# EAGLE design Controller + Power (Sliced) (EAGLE 9.6.2)
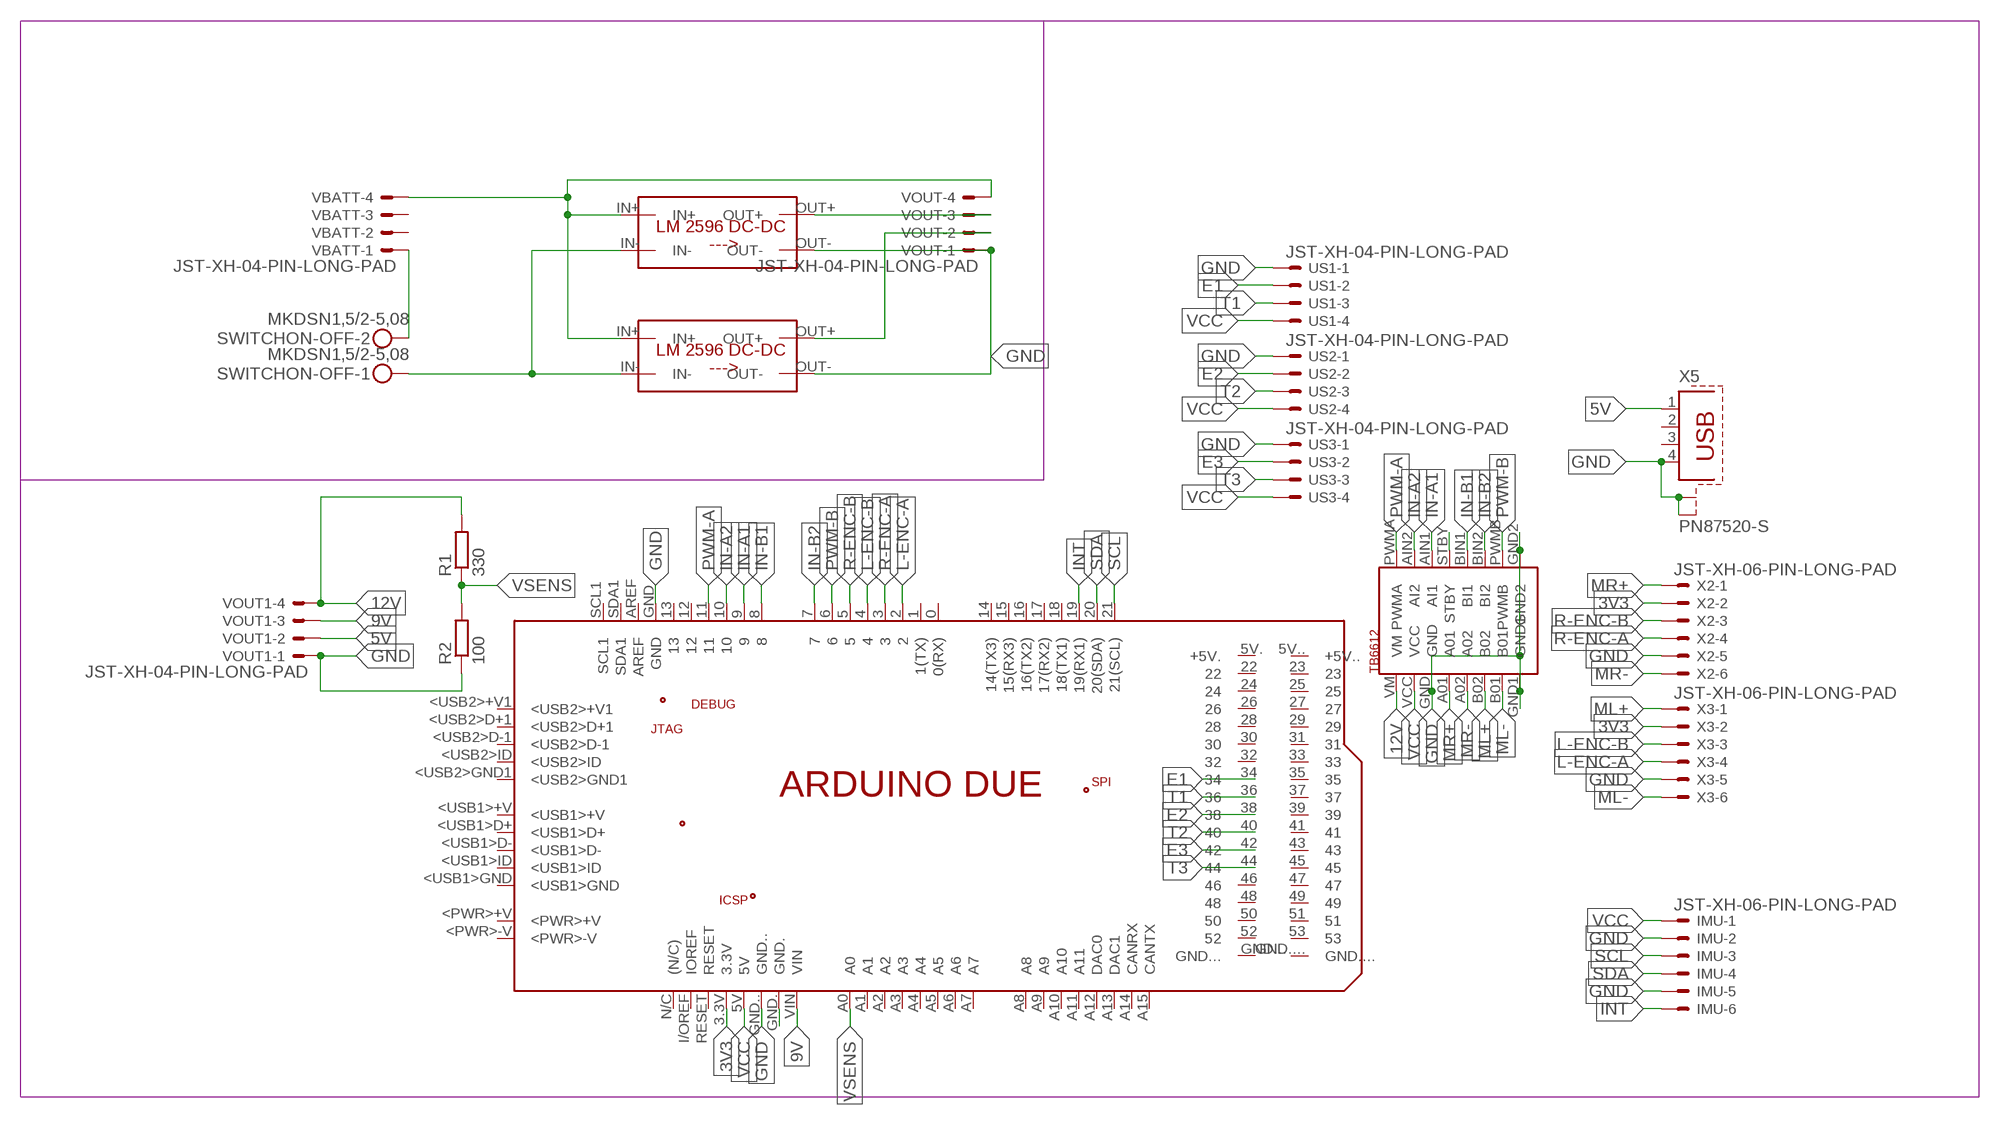
[diagram p0: schematic, sheet 1]

## Parts
IMU  JST-XH-06-PIN-LONG-PAD  [JST-XH-06-PACKAGE-LONG-PAD]
PCB1  ARDUINO_DUE  [ARDUINO_DUE]
R1  330  R-EU_R1206  [R1206]
R2  100  R-EU_R1206  [R1206]
SWITCHON-OFF  MKDSN1,5/2-5,08  [MKDSN1,5/2-5,08]
U$1  LM2596_MODBUCK  [LM2596_MOD]
U$2  LM2596_MODBUCK  [LM2596_MOD]
U$3  TB6612  [TB6612]
US1  JST-XH-04-PIN-LONG-PAD  [JST-XH-04-PACKAGE-LONG-PAD]
US2  JST-XH-04-PIN-LONG-PAD  [JST-XH-04-PACKAGE-LONG-PAD]
US3  JST-XH-04-PIN-LONG-PAD  [JST-XH-04-PACKAGE-LONG-PAD]
VBATT  JST-XH-04-PIN-LONG-PAD  [JST-XH-04-PACKAGE-LONG-PAD]
VOUT  JST-XH-04-PIN-LONG-PAD  [JST-XH-04-PACKAGE-LONG-PAD]
VOUT1  JST-XH-04-PIN-LONG-PAD  [JST-XH-04-PACKAGE-LONG-PAD]
X2  JST-XH-06-PIN-LONG-PAD  [JST-XH-06-PACKAGE-LONG-PAD]
X3  JST-XH-06-PIN-LONG-PAD  [JST-XH-06-PACKAGE-LONG-PAD]
X5  PN87520-S  [PN87520-S]

## Nets
3V3: PCB1.3.3V X2.2 X3.2
5V: VOUT1.2 X5.1
9V: PCB1.VIN VOUT1.3
12V: R1.2 U$3.VM VOUT1.4
E1: PCB1.34 US1.2
E2: PCB1.38 US2.2
E3: PCB1.42 US3.2
GND: IMU.2 IMU.5 PCB1.GND PCB1.GND.. R2.1 U$1.OUT- U$2.OUT- U$3.GND U$3.GND1 U$3.GND2 US1.1 US2.1 US3.1 VOUT1.1 VOUT.1 X2.5 X3.5 X5.4 X5.S1 X5.S2
IN-A1: PCB1.9 U$3.AIN1(AI1)
IN-A2: PCB1.10 U$3.AIN2(AI2)
IN-B1: PCB1.8 U$3.BIN1(BI1)
IN-B2: PCB1.7 U$3.BIN2(BI2)
INT: IMU.6 PCB1.19(19(RX1))
L-ENC-A: PCB1.2 X3.4
L-ENC-B: PCB1.4 X3.3
ML+: U$3.B02 X3.1
ML-: U$3.B01 X3.6
MR+: U$3.A01 X2.1
MR-: U$3.A02 X2.6
N$1: U$1.IN+ U$2.IN+ VBATT.4 VOUT.4
N$2: SWITCHON-OFF.2 VBATT.1
N$3: SWITCHON-OFF.1 U$1.IN- U$2.IN-
N$4: U$2.OUT+ VOUT.3
N$5: U$1.OUT+ VOUT.2
N$8: PCB1.GND.
N$12: U$3.STBY
PWM-A: PCB1.11 U$3.PWMA
PWM-B: PCB1.6 U$3.PWMB
R-ENC-A: PCB1.3 X2.4
R-ENC-B: PCB1.5 X2.3
SCL: IMU.3 PCB1.21(21(SCL))
SDA: IMU.4 PCB1.20(20(SDA))
T1: PCB1.36 US1.3
T2: PCB1.40 US2.3
T3: PCB1.44 US3.3
VCC: IMU.1 PCB1.5V U$3.VCC US1.4 US2.4 US3.4
VSENS: PCB1.A0 R1.1 R2.2
Unconnected: PCB1.0(0(RX)) PCB1.1(1(TX)) PCB1.5V.(+5V.) PCB1.5V..(+5V..) PCB1.12 PCB1.13 PCB1.14(14(TX3)) PCB1.15(15(RX3)) PCB1.16(16(TX2)) PCB1.17(17(RX2)) PCB1.18(18(TX1)) PCB1.22 PCB1.23 PCB1.24 PCB1.25 PCB1.26 PCB1.27 PCB1.28 PCB1.29 PCB1.30 PCB1.31 PCB1.32 PCB1.33 PCB1.35 PCB1.37 PCB1.39 PCB1.41 PCB1.43 PCB1.45 PCB1.46 PCB1.47 PCB1.48 PCB1.49 PCB1.50 PCB1.51 PCB1.52 PCB1.53 PCB1.+3.3V PCB1.+5V PCB1.+5V_ PCB1.<PWR>+V PCB1.<PWR>-V PCB1.<USB1>+V PCB1.<USB1>D+ PCB1.<USB1>D- PCB1.<USB1>GND PCB1.<USB1>ID PCB1.<USB2>+V1 PCB1.<USB2>D+1 PCB1.<USB2>D-1 PCB1.<USB2>GND1 PCB1.<USB2>ID PCB1.A1 PCB1.A2 PCB1.A3 PCB1.A4 PCB1.A5 PCB1.A6 PCB1.A7 PCB1.A8 PCB1.A9 PCB1.A10 PCB1.A11 PCB1.A12(DAC0) PCB1.A13(DAC1) PCB1.A14(CANRX) PCB1.A15(CANTX) PCB1.AREF PCB1.GND1 PCB1.GND1. PCB1.GND1.. PCB1.GND1... PCB1.GND... PCB1.GND.... PCB1.GND_ PCB1.GND__ PCB1.I/OREF(IOREF) PCB1.MISO PCB1.MISO2 PCB1.MOSI PCB1.MOSI2 PCB1.N/C((N/C)) PCB1.N/C. PCB1.RESET PCB1.RESET2 PCB1.RESET. PCB1.RESET.. PCB1.RESET_ PCB1.SCK PCB1.SCK2 PCB1.SCL1 PCB1.SDA1 PCB1.SWCLK PCB1.SWDIO PCB1.TCK PCB1.TDI PCB1.TDO PCB1.TMS VBATT.2 VBATT.3 X5.2 X5.3

## Library data of the parts
IMU X2 X3 = Rembrandt Electronics - JST XH Connectors v1-0:JST-XH-06-PIN: JST XH Connector 2 Pin Wire to board connector. Pitch: 2,54 mm, (0.100") Number of pins: 6 Created by Rembrandt Electronics www.rembrandtelectronics.com
PCB1 = E14_Arduino_revC:ARDUINO_DUE: Device for representing an Arduino Due board with a footprint in an EAGLE design. Created by Dave Young for Element14. More EAGLE documentation at: http://www.element14.com/community/community/knode/cadsoft_eagle
R1 R2 = rcl:R-EU_: RESISTOR, European symbol; SPICEPREFIX: R
SWITCHON-OFF = con-phoenix-508:MKDSN1,5/2-5,08: MKDSN 1,5/ 2-5,08 Printklemme Nennstrom: 13,5 A Nennspannung: 250 V Rastermaß: 5,08 mm Polzahl: 2 Anschlussart: Schraubanschluss Montage: Löten Anschlussrichtung Leiter/Platine: 0 ° Artikelnummer: 1729128 Source: http://eshop.phoenixcontact.com .. 1729128.pdf
U$1 U$2 = LM2596:LM2596_MOD
U$3 = DRIVER-MOTOR-TB6612:TB6612
US1-US3 VBATT VOUT VOUT1 = Rembrandt Electronics - JST XH Connectors v1-0:JST-XH-04-PIN: JST XH Connector 2 Pin Wire to board connector. Pitch: 2,54 mm, (0.100") Number of pins: 4 Created by Rembrandt Electronics www.rembrandtelectronics.com
X5 = con-berg:PN87520-S; OC_FARNELL: unknown; OC_NEWARK: unknown

## Board
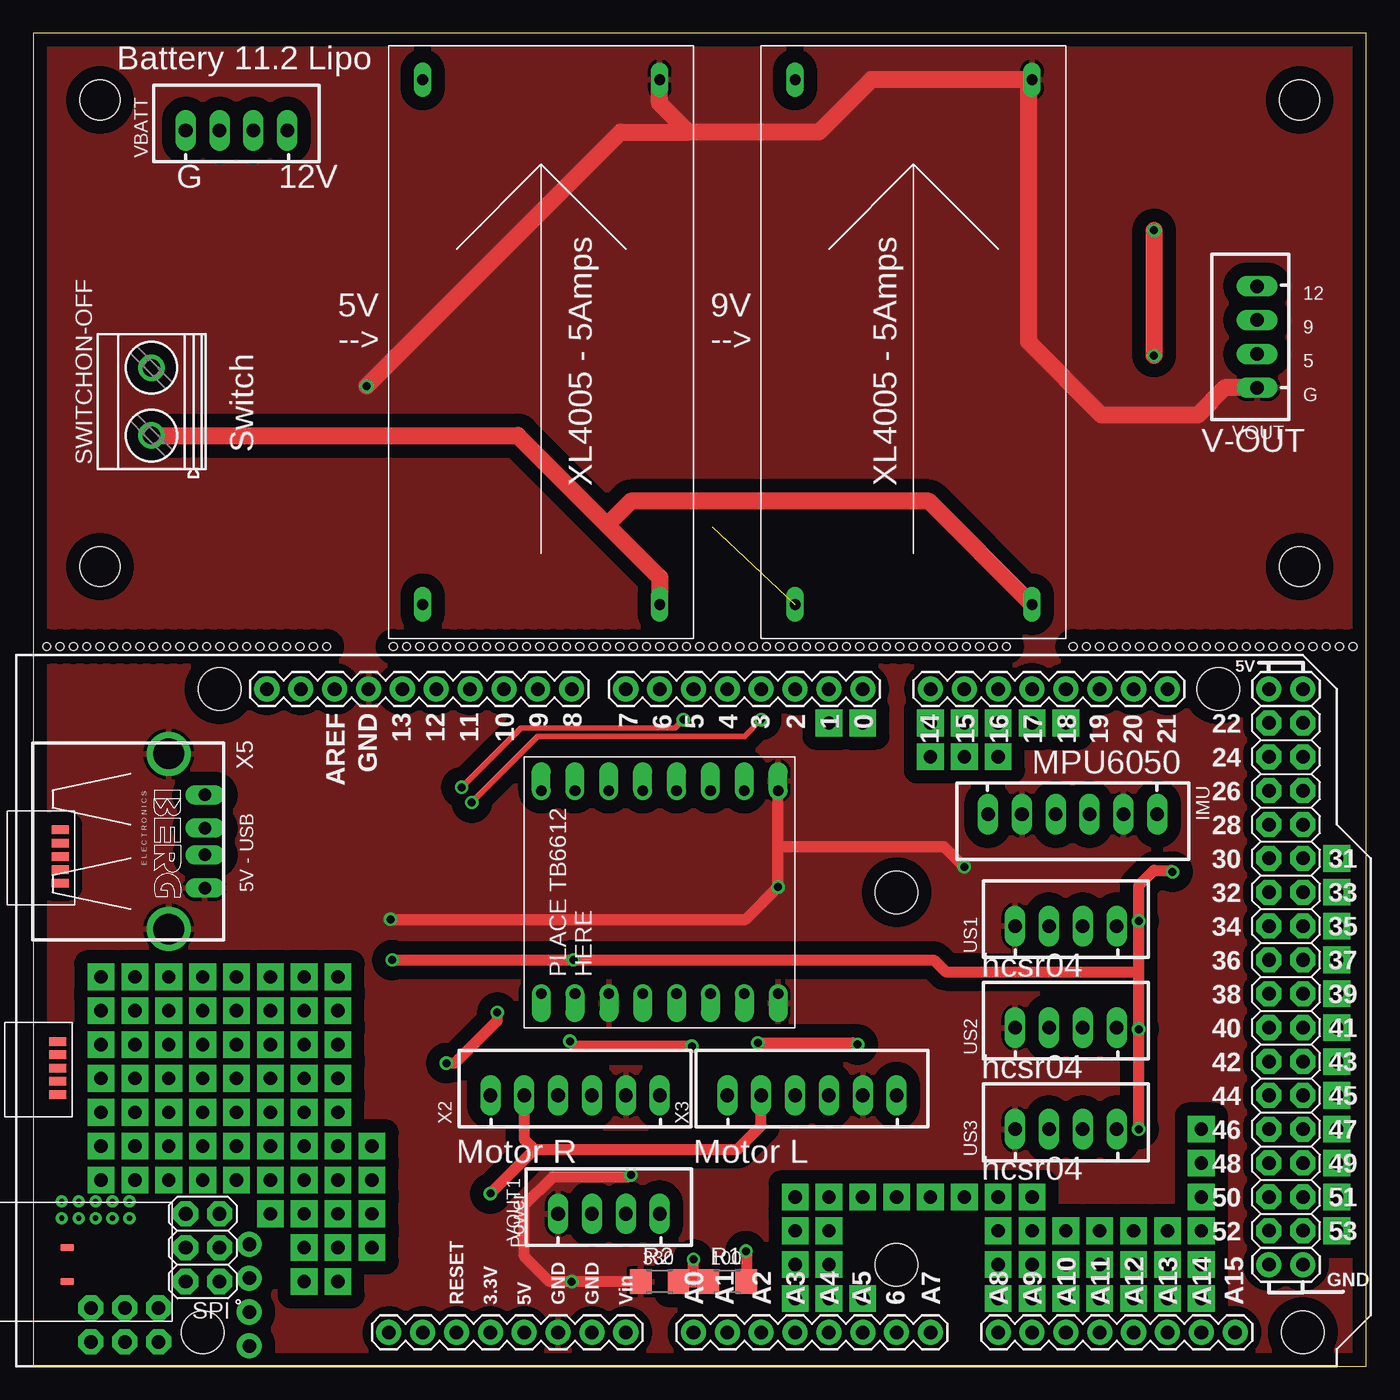
[diagram p1: board, top side]
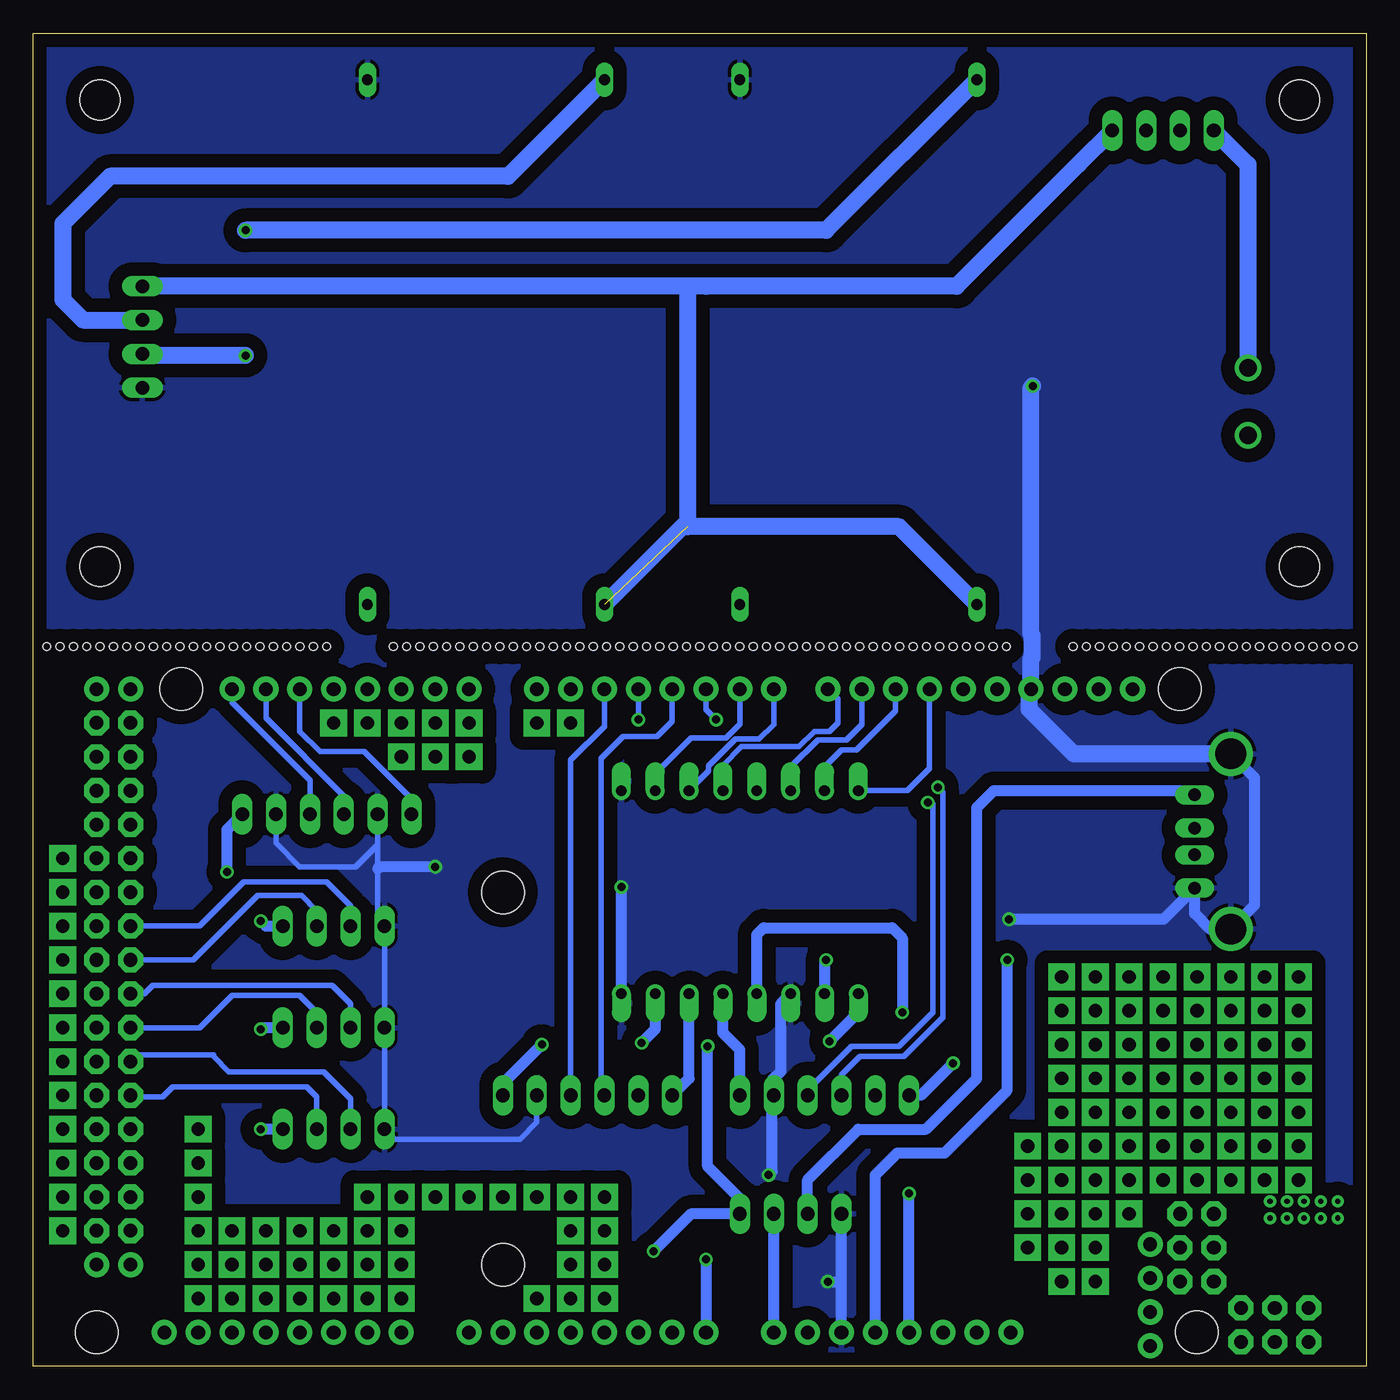
[diagram p2: board, bottom side, seen from below]

Size 100 x 100 mm. Coordinates in mm from the lower left corner, seen from the top.
Outline: 0,0 100,0 100,100 0,100 0,0
Copper layers (1*16): Top 0.035mm / dielectric 1.5mm / Bottom 0.035mm
Design rules "default": minimum track width 6mil, minimum drill 0.35mm, track to track 6mil, track to pad 6mil, pad to pad 6mil, via to via 6mil, smd to smd 6mil, copper to edge 40mil, drill to drill 6mil, minimum pad ring 10mil, minimum via ring 8mil, stop-mask expansion 4mil, vias tented up to drill 0mil, thermal gap 10mil
Holes 0.6 mm at 27,54 28,54 29,54 30,54 31,54 32,54 33,54 34,54 35,54 36,54 37,54 38,54 39,54 40,54 41,54 42,54 44,54 43,54 45,54 46,54 47,54 48,54 49,54 50,54 51,54 52,54 53,54 54,54 55,54 56,54 57,54 58,54 59,54 60,54 61,54 62,54 63,54 64,54 65,54 66,54 67,54 68,54 69,54 70,54 71,54 72,54 73,54 22,54 21,54 20,54 19,54 18,54 17,54 16,54 15,54 14,54 13,54 12,54 11,54 10,54 9,54 8,54 7,54 6,54 1,54 2,54 3,54 4,54 5,54 99,54 98,54 97,54 96,54 95,54 94,54 93,54 92,54 91,54 90,54 89,54 88,54 87,54 86,54 85,54 84,54 83,54 82,54 81,54 80,54 79,54 78,54
Holes 3 mm at 5,95 95,95 95,60 5,60

### Footprints (pad centres in the part's own frame; a part is rotated, then mirrored left to right if it is on the bottom)
JST-XH-06-PACKAGE-LONG-PAD = drill 1.016 long: 1 -6.35,0; 2 -3.81,0; 3 -1.27,0; 4 1.27,0; 5 3.81,0; 6 6.35,0
ARDUINO_DUE = drill 1.016 pad 1.88: 0 63.5,50.8; 1 60.96,50.8; 2 58.42,50.8; 3 55.88,50.8; 3.3V 35.56,2.54; 4 53.34,50.8; 5 50.8,50.8; 5V 38.1,2.54; 5V. 93.98,50.8; 5V.. 96.52,50.8; 6 48.26,50.8; 7 45.72,50.8; 8 41.656,50.8; 9 39.116,50.8; 10 36.576,50.8; 11 34.036,50.8; 12 31.496,50.8; 13 28.956,50.8; 14 68.58,50.8; 15 71.12,50.8; 16 73.66,50.8; 17 76.2,50.8; 18 78.74,50.8; 19 81.28,50.8; 20 83.82,50.8; 21 86.36,50.8; A0 50.8,2.54; A1 53.34,2.54; A2 55.88,2.54; A3 58.42,2.54; A4 60.96,2.54; A5 63.5,2.54; A6 66.04,2.54; A7 68.58,2.54; A8 73.66,2.54; A9 76.2,2.54; A10 78.74,2.54; A11 81.28,2.54; A12 83.82,2.54; A13 86.36,2.54; A14 88.9,2.54; A15 91.44,2.54; AREF 23.876,50.8; GND 26.416,50.8; GND1 17.475,9.144; GND. 43.18,2.54; GND.. 40.64,2.54; GND... 93.98,7.62; GND.... 96.52,7.62; I/OREF 30.48,2.54; N/C 27.94,2.54; RESET 33.02,2.54; RESET.. 17.475,1.524; SCL1 18.796,50.8; SDA1 21.336,50.8; SWCLK 17.475,6.604; SWDIO 17.475,4.064; VIN 45.72,2.54 | drill 1.016 pad 1.88 octagon: 22 93.98,48.26; 23 96.52,48.26; 24 93.98,45.72; 25 96.52,45.72; 26 93.98,43.18; 27 96.52,43.18; 28 93.98,40.64; 29 96.52,40.64; 30 93.98,38.1; 31 96.52,38.1; 32 93.98,35.56; 33 96.52,35.56; 34 93.98,33.02; 35 96.52,33.02; 36 93.98,30.48; 37 96.52,30.48; 38 93.98,27.94; 39 96.52,27.94; 40 93.98,25.4; 41 96.52,25.4; 42 93.98,22.86; 43 96.52,22.86; 44 93.98,20.32; 45 96.52,20.32; 46 93.98,17.78; 47 96.52,17.78; 48 93.98,15.24; 49 96.52,15.24; 50 93.98,12.7; 51 96.52,12.7; 52 93.98,10.16; 53 96.52,10.16; +5V 5.588,4.369; +5V_ 12.7,6.35; GND_ 10.668,4.369; GND__ 12.7,11.43; MISO 15.24,6.35; MISO2 5.588,1.829; MOSI 12.7,8.89; MOSI2 8.128,4.369; RESET2 10.668,1.829; RESET. 15.24,11.43; SCK 15.24,8.89; SCK2 8.128,1.829 | drill 0.406 pad 0.61: +3.3V 8.484,12.37; GND1. 7.214,12.37; GND1.. 5.944,12.37; GND1... 3.404,12.37; N/C. 4.674,12.37; RESET_ 3.404,11.1; TCK 7.214,11.1; TDI 4.674,11.1; TDO 5.944,11.1; TMS 8.484,11.1 | smd 1.016 x 0.508: <PWR>+V 3.81,8.89; <PWR>-V 3.81,6.35 | smd 1.27 x 0.635: <USB1>+V 3.099,24.359; <USB1>D+ 3.099,23.368; <USB1>D- 3.099,22.352; <USB1>GND 3.099,20.371; <USB1>ID 3.099,21.387; <USB2>+V1 3.302,40.234; <USB2>D+1 3.302,39.243; <USB2>D-1 3.302,38.227; <USB2>GND1 3.302,36.246; <USB2>ID 3.302,37.262 | hole 3.2: 15.24,50.8; 13.97,2.54; 66.04,35.56; 66.04,7.62; 90.17,50.8; 96.52,2.54
R1206 = smd 1.6 x 1.803: 1 -1.422,0; 2 1.422,0
MKDSN1,5/2-5,08 = drill 1.3 pad 2: 1 -2.561,0.025; 2 2.519,0.025
LM2596_MOD = drill 0.8 long: IN+ -11.43,6.35; IN- -11.43,-11.43; OUT+ 27.94,6.35; OUT- 27.94,-11.43
TB6612 = drill 0.8 pad 1.422 offset: A01 -7.62,1.27; A02 -7.62,-1.27; AIN1 7.62,3.81; AIN2 7.62,6.35; B01 -7.62,-6.35; B02 -7.62,-3.81; BIN1 7.62,-1.27; BIN2 7.62,-3.81; GND -7.62,3.81; GND1 -7.62,-8.89; GND2 7.62,-8.89; PWMA 7.62,8.89; PWMB 7.62,-6.35; STBY 7.62,1.27; VCC -7.62,6.35; VM -7.62,8.89
JST-XH-04-PACKAGE-LONG-PAD = drill 1.016 long: 1 -3.81,0; 2 -1.27,0; 3 1.27,0; 4 3.81,0
PN87520-S = drill 0.95 long: 1 -3.5,2.71; 2 -1,2.71; 3 1,2.71; 4 3.5,2.71 | drill 2.3 pad 2.9: S1 -6.57,0; S2 6.57,0

### Placement (x,y rotation side)
IMU  77.98,41.4 180 top
PCB1  -1.27,0 0 top
R1  52.07,6.35 0 top
R2  46.99,6.35 0 top
SWITCHON-OFF  8.89,72.39 90 top
U$1  35.56,68.58 90 top
U$2  63.5,68.58 90 top
U$3  46.99,35.56 90 top
US1  77.47,33.02 0 top
US2  77.47,25.4 0 top
US3  77.47,17.78 0 top
VBATT  15.24,92.71 0 top
VOUT  91.82,77.22 90 top
VOUT1  43.18,11.43 0 top
X2  40.64,20.32 0 top
X3  58.42,20.32 0 top
X5  10.16,39.37 270 top

### Tracks (layer width: path | path; a pad name or v marks a point on that pad's centre or on a via)
3V3  (via drill 0.6)
  Top 0.813: v34.29,12.95 37.59,16.26 | X3.2 54.61,18.03 52.83,16.26 37.59,16.26 | X2.2 36.83,17.02 37.59,16.26
  Bottom 0.813: PCB1.3.3V v34.29,12.95
5V
  Bottom 0.813: VOUT1.2 41.91,13.97 38.1,17.78 33.02,17.78 29.21,21.59 29.21,41.91 27.94,43.18 12.7,43.18 12.7,43.04 X5.1
9V
  Bottom 0.813: PCB1.VIN VOUT1.3
12V  (via drill 0.6)
  Top 0.813: v53.47,8.64 53.49,8.61 R1.2 | v40.26,24.38 40.64,24 v49.4,24
  Bottom 0.813: v53.47,8.64 50.67,11.43 VOUT1.4 46.99,12.57 49.4,14.99 v49.4,24 | v40.26,24.38 38.1,26.54 U$3.VM
E1
  Bottom 0.406: PCB1.34 87.5,33.02 84.2,36.32 77.98,36.32 76.2,34.54 US1.2
E2
  Bottom 0.406: US2.2 76.2,27.18 77.6,28.57 91.06,28.57 91.69,27.94 PCB1.38
E3
  Bottom 0.406: US3.2 76.2,20.07 78.23,22.1 85.34,22.1 86.49,23.24 86.49,23.37 92.2,23.37 PCB1.42
GND  (via drill 0.6)
  Top 0.813: R2.1 v40.39,6.35 38.73,6.35 36.83,8.26 36.83,12.06 38.99,14.22 44.7,14.22 v44.83,14.35 | v26.8,33.53 53.47,33.53 v55.88,35.94 55.88,38.99 | 55.88,38.99 U$3.GND2 | v69.85,37.47 68.33,38.99 55.88,38.99
  Top 1.27: 49.15,92.58 58.93,92.58 62.87,96.52 U$2.OUT- 74.68,96.27 74.68,76.83 80.14,71.37 87.38,71.37 89.41,73.41 VOUT.1 | U$1.OUT- 46.99,94.74 49.15,92.58 | v25.02,73.53 44.07,92.58 49.15,92.58
  Bottom 0.406: X3.5 62.23,18.29 63.5,17.02 72.9,17.02 US3.1 US2.1 US1.1 74.17,33.53 74.17,37.34 IMU.5 74.17,39.12 75.82,37.47 80.01,37.47 81.79,39.24 IMU.2
  Bottom 0.813: PCB1.GND.. 39.37,6.35 | 39.37,6.35 VOUT1.1 | v40.39,6.35 39.37,6.35 | X5.S1 8.38,44.16 8.38,34.58 X5.S2 11.72,32.8 12.87,33.95 X5.4 15.21,33.53 v26.8,33.53 | U$3.GND1 v55.88,35.94 | U$3.GND 43.94,27.18 43.94,22.1 44.58,21.46 44.58,20.45 | 44.58,20.45 X2.5 | v44.83,14.35 44.58,14.61 44.58,20.45 | v69.85,37.47 74.04,37.47 74.17,37.34
  Bottom 1.27: X5.S1 21.94,45.94 25.27,49.28 25.27,50.67 PCB1.GND 25.15,53.09 25.05,53.19 25.05,54.81 25.15,54.91 25.15,73.41 v25.02,73.53
  pour Top (isolate 1.016): -10,-10 110,-10 110,110 -10,110
  pour Bottom (isolate 1.016): -20,0 100,0 100,110 -20,110
IN-A1
  Bottom 0.406: PCB1.9 37.85,48.13 38.99,46.99 41.15,46.99 43.18,44.96 U$3.AIN1
IN-A2
  Bottom 0.406: PCB1.10 35.31,49.15 38.23,46.23 39.37,46.23 40.64,44.96 U$3.AIN2
IN-B1
  Bottom 0.406: PCB1.8 39.62,50.04 39.62,48.26 40.26,47.62 41.4,47.62 42.55,46.48 46.86,46.48 48.26,45.09 U$3.BIN1
IN-B2
  Bottom 0.406: PCB1.7 44.45,48.13 45.54,47.04 47.33,47.04 49.33,45.04 49.33,44.65 U$3.BIN2
INT
  Bottom 0.406: IMU.6 71.63,42.55 75.18,46.1 78.49,46.1 80.01,47.62 PCB1.19
L-ENC-A
  Bottom 0.406: X3.4 59.69,45.47 57.15,48.01 PCB1.2
L-ENC-B
  Bottom 0.406: PCB1.4 52.07,48.39 53.21,47.24 55.75,47.24 57.4,45.59 57.4,20.57 X3.3
ML+
  Bottom 0.813: X3.1 50.8,21.59 U$3.B02
ML-  (via drill 0.6)
  Top 0.813: v54.36,24.26 61.47,24.26 61.59,24.13 v61.85,24.13
  Bottom 0.813: U$3.B01 53.34,25.27 v54.36,24.26 | v61.85,24.13 64.77,21.21 X3.6
MR+  (via drill 0.6)
  Top 0.813: v34.8,26.54 34.8,25.91 31.62,22.73 v30.99,22.73
  Bottom 0.813: U$3.A01 45.72,32.38 45.21,32.89 35.56,32.89 34.8,32.13 v34.8,26.54 | v30.99,22.73 33.4,20.32 X2.1
MR-
  Bottom 0.813: X2.6 46.99,23.75 48.26,25.02 U$3.A02
N$1  (1 unrouted)
  Bottom 1.27: VBATT.4 21.59,90.17 30.73,81.03 49.53,81.03 50.93,81.03 | 50.93,81.03 VOUT.4 | 50.93,81.03 50.93,63.37 U$2.IN+ | U$1.IN+ 35.05,62.99 50.93,62.99
N$2
  Bottom 1.27: VBATT.1 8.87,90.14 SWITCHON-OFF.2
N$3
  Top 1.27: SWITCHON-OFF.1 36.34,69.83 43.05,63.12 | U$1.IN- 46.99,59.18 43.05,63.12 | U$2.IN- 67.18,64.9 44.83,64.9 43.05,63.12
N$4
  Bottom 1.27: U$2.OUT+ 64.39,89.28 94.23,89.28 97.79,85.72 97.79,80.01 96.27,78.49 VOUT.3
N$5  (via drill 0.6)
  Top 1.27: v84.07,85.22 v84.07,75.82
  Bottom 1.27: U$1.OUT+ 40.51,85.22 v84.07,85.22 | v84.07,75.82 91.69,75.82 VOUT.2
N$6  (via drill 1 pad 2)
  other vias: 72.39,5.08
N$7  (via drill 1 pad 2)
  other vias: 74.93,5.08
N$9  (via drill 1 pad 2)
  other vias: 77.47,5.08
N$10  (via drill 1 pad 2)
  other vias: 80.01,5.08
N$11  (via drill 1 pad 2)
  other vias: 82.55,5.08
N$13  (via drill 1 pad 2)
  other vias: 85.09,5.08
N$14  (via drill 1 pad 2)
  other vias: 87.63,5.08
N$15  (via drill 1 pad 2)
  other vias: 87.63,7.62
N$16  (via drill 1 pad 2)
  other vias: 85.09,7.62
N$17  (via drill 1 pad 2)
  other vias: 82.55,7.62
N$18  (via drill 1 pad 2)
  other vias: 80.01,7.62
N$19  (via drill 1 pad 2)
  other vias: 77.47,7.62
N$20  (via drill 1 pad 2)
  other vias: 74.93,7.62
N$21  (via drill 1 pad 2)
  other vias: 72.39,7.62
N$22  (via drill 1 pad 2)
  other vias: 12.7,29.21
N$23  (via drill 1 pad 2)
  other vias: 15.24,29.21
N$24  (via drill 1 pad 2)
  other vias: 17.78,29.21
N$25  (via drill 1 pad 2)
  other vias: 20.32,29.21
N$26  (via drill 1 pad 2)
  other vias: 22.86,29.21
N$27  (via drill 1 pad 2)
  other vias: 10.16,29.21
N$28  (via drill 1 pad 2)
  other vias: 7.62,29.21
N$29  (via drill 1 pad 2)
  other vias: 5.08,29.21
N$30  (via drill 1 pad 2)
  other vias: 12.7,26.67
N$31  (via drill 1 pad 2)
  other vias: 15.24,26.67
N$32  (via drill 1 pad 2)
  other vias: 17.78,26.67
N$33  (via drill 1 pad 2)
  other vias: 20.32,26.67
N$34  (via drill 1 pad 2)
  other vias: 22.86,26.67
N$35  (via drill 1 pad 2)
  other vias: 10.16,26.67
N$36  (via drill 1 pad 2)
  other vias: 7.62,26.67
N$37  (via drill 1 pad 2)
  other vias: 5.08,26.67
N$38  (via drill 1 pad 2)
  other vias: 12.7,24.13
N$39  (via drill 1 pad 2)
  other vias: 15.24,24.13
N$40  (via drill 1 pad 2)
  other vias: 17.78,24.13
N$41  (via drill 1 pad 2)
  other vias: 20.32,24.13
N$42  (via drill 1 pad 2)
  other vias: 22.86,24.13
N$43  (via drill 1 pad 2)
  other vias: 10.16,24.13
N$44  (via drill 1 pad 2)
  other vias: 7.62,24.13
N$45  (via drill 1 pad 2)
  other vias: 5.08,24.13
N$46  (via drill 1 pad 2)
  other vias: 12.7,21.59
N$47  (via drill 1 pad 2)
  other vias: 15.24,21.59
N$48  (via drill 1 pad 2)
  other vias: 17.78,21.59
N$49  (via drill 1 pad 2)
  other vias: 20.32,21.59
N$50  (via drill 1 pad 2)
  other vias: 22.86,21.59
N$51  (via drill 1 pad 2)
  other vias: 10.16,21.59
N$52  (via drill 1 pad 2)
  other vias: 7.62,21.59
N$53  (via drill 1 pad 2)
  other vias: 5.08,21.59
N$54  (via drill 1 pad 2)
  other vias: 12.7,19.05
N$55  (via drill 1 pad 2)
  other vias: 15.24,19.05
N$56  (via drill 1 pad 2)
  other vias: 17.78,19.05
N$57  (via drill 1 pad 2)
  other vias: 20.32,19.05
N$58  (via drill 1 pad 2)
  other vias: 22.86,19.05
N$59  (via drill 1 pad 2)
  other vias: 10.16,19.05
N$60  (via drill 1 pad 2)
  other vias: 7.62,19.05
N$61  (via drill 1 pad 2)
  other vias: 5.08,19.05
N$62  (via drill 1 pad 2)
  other vias: 12.7,16.51
N$63  (via drill 1 pad 2)
  other vias: 15.24,16.51
N$64  (via drill 1 pad 2)
  other vias: 17.78,16.51
N$65  (via drill 1 pad 2)
  other vias: 20.32,16.51
N$66  (via drill 1 pad 2)
  other vias: 22.86,16.51
N$67  (via drill 1 pad 2)
  other vias: 10.16,16.51
N$68  (via drill 1 pad 2)
  other vias: 7.62,16.51
N$69  (via drill 1 pad 2)
  other vias: 5.08,16.51
N$70  (via drill 1 pad 2)
  other vias: 12.7,13.97
N$71  (via drill 1 pad 2)
  other vias: 15.24,13.97
N$72  (via drill 1 pad 2)
  other vias: 17.78,13.97
N$73  (via drill 1 pad 2)
  other vias: 20.32,13.97
N$74  (via drill 1 pad 2)
  other vias: 22.86,13.97
N$75  (via drill 1 pad 2)
  other vias: 10.16,13.97
N$76  (via drill 1 pad 2)
  other vias: 7.62,13.97
N$77  (via drill 1 pad 2)
  other vias: 5.08,13.97
N$78  (via drill 1 pad 2)
  other vias: 25.4,13.97
N$79  (via drill 1 pad 2)
  other vias: 25.4,16.51
N$80  (via drill 1 pad 2)
  other vias: 25.4,11.43
N$81  (via drill 1 pad 2)
  other vias: 22.86,11.43
N$82  (via drill 1 pad 2)
  other vias: 20.32,11.43
N$83  (via drill 1 pad 2)
  other vias: 17.78,11.43
N$84  (via drill 1 pad 2)
  other vias: 20.32,8.89
N$85  (via drill 1 pad 2)
  other vias: 22.86,8.89
N$86  (via drill 1 pad 2)
  other vias: 25.4,8.89
N$87  (via drill 1 pad 2)
  other vias: 22.86,6.35
N$88  (via drill 1 pad 2)
  other vias: 20.32,6.35
N$89  (via drill 1 pad 2)
  other vias: 72.39,10.16
N$90  (via drill 1 pad 2)
  other vias: 74.93,10.16
N$91  (via drill 1 pad 2)
  other vias: 77.47,10.16
N$92  (via drill 1 pad 2)
  other vias: 80.01,10.16
N$93  (via drill 1 pad 2)
  other vias: 82.55,10.16
N$94  (via drill 1 pad 2)
  other vias: 85.09,10.16
N$95  (via drill 1 pad 2)
  other vias: 87.63,10.16
N$96  (via drill 1 pad 2)
  other vias: 87.63,12.7
N$97  (via drill 1 pad 2)
  other vias: 87.63,15.24
N$98  (via drill 1 pad 2)
  other vias: 87.63,17.78
N$99  (via drill 1 pad 2)
  other vias: 97.79,10.16
N$100  (via drill 1 pad 2)
  other vias: 97.79,12.7
N$101  (via drill 1 pad 2)
  other vias: 97.79,15.24
N$102  (via drill 1 pad 2)
  other vias: 97.79,17.78
N$103  (via drill 1 pad 2)
  other vias: 97.79,20.32
N$104  (via drill 1 pad 2)
  other vias: 97.79,22.86
N$105  (via drill 1 pad 2)
  other vias: 97.79,25.4
N$106  (via drill 1 pad 2)
  other vias: 97.79,27.94
N$107  (via drill 1 pad 2)
  other vias: 97.79,30.48
N$108  (via drill 1 pad 2)
  other vias: 97.79,33.02
N$109  (via drill 1 pad 2)
  other vias: 97.79,35.56
N$110  (via drill 1 pad 2)
  other vias: 97.79,38.1
N$111  (via drill 1 pad 2)
  other vias: 59.69,48.26
N$112  (via drill 1 pad 2)
  other vias: 62.23,48.26
N$113  (via drill 1 pad 2)
  other vias: 67.31,48.26
N$114  (via drill 1 pad 2)
  other vias: 69.85,48.26
N$115  (via drill 1 pad 2)
  other vias: 72.39,48.26
N$116  (via drill 1 pad 2)
  other vias: 74.93,48.26
N$117  (via drill 1 pad 2)
  other vias: 77.47,48.26
N$118  (via drill 1 pad 2)
  other vias: 67.31,45.72
N$119  (via drill 1 pad 2)
  other vias: 69.85,45.72
N$120  (via drill 1 pad 2)
  other vias: 72.39,45.72
N$121  (via drill 1 pad 2)
  other vias: 57.15,5.08
N$122  (via drill 1 pad 2)
  other vias: 59.69,5.08
N$123  (via drill 1 pad 2)
  other vias: 62.23,5.08
N$124  (via drill 1 pad 2)
  other vias: 57.15,7.62
N$125  (via drill 1 pad 2)
  other vias: 59.69,7.62
N$126  (via drill 1 pad 2)
  other vias: 59.69,10.16
N$127  (via drill 1 pad 2)
  other vias: 57.15,10.16
N$128  (via drill 1 pad 2)
  other vias: 57.15,12.7
N$129  (via drill 1 pad 2)
  other vias: 59.69,12.7
N$130  (via drill 1 pad 2)
  other vias: 62.23,12.7
N$131  (via drill 1 pad 2)
  other vias: 64.77,12.7
N$132  (via drill 1 pad 2)
  other vias: 67.31,12.7
N$133  (via drill 1 pad 2)
  other vias: 69.85,12.7
N$134  (via drill 1 pad 2)
  other vias: 72.39,12.7
N$135  (via drill 1 pad 2)
  other vias: 74.93,12.7
PWM-A
  Bottom 0.406: U$3.PWMA 34.42,43.18 32.77,44.83 PCB1.11
PWM-B
  Bottom 0.406: U$3.PWMB 53.34,44.45 50.67,47.12 48.04,47.12 46.99,48.17 PCB1.6
R-ENC-A  (via drill 0.6)
  Top 0.406: v32.89,42.29 37.85,47.24 53.34,47.24 v54.61,48.51
  Bottom 0.406: X2.4 41.91,20.7 38.61,24 35.05,24 32.51,26.54 32.51,42.16 32.64,42.29 v32.89,42.29 | v54.61,48.51 PCB1.3
R-ENC-B  (via drill 0.6)
  Top 0.406: v32.13,43.43 36.58,47.88 48.13,47.88 v48.77,48.51
  Bottom 0.406: X2.3 39.37,21.84 37.97,23.24 34.67,23.24 31.75,26.16 31.75,43.05 v32.13,43.43 | v48.77,48.51 49.53,49.28 PCB1.5
SCL
  Bottom 0.406: IMU.3 79.25,43.94 85.09,49.78 PCB1.21
SDA
  Bottom 0.406: PCB1.20 82.55,48.64 76.71,42.8 IMU.4
T1
  Bottom 0.406: PCB1.36 88.01,30.48 83.19,35.31 79.88,35.31 78.74,34.16 US1.3
T2
  Bottom 0.406: PCB1.40 87.5,25.4 85.09,27.81 80.01,27.81 78.74,26.54 US2.3
T3
  Bottom 0.406: US3.3 78.74,20.19 79.5,20.95 89.53,20.95 90.3,20.19 92.58,20.19 PCB1.44
VCC  (via drill 0.6)
  Top 0.813: v82.93,17.78 v82.93,25.27 82.93,29.84 | 82.93,29.84 v82.93,33.4 82.93,36.07 84.07,37.21 85.34,37.21 v85.47,37.08 | v26.92,30.48 v40.51,30.48 67.56,30.48 68.45,29.59 82.68,29.59 82.93,29.84
  Bottom 0.813: US3.4 v82.93,17.78 | v82.93,33.4 82.55,33.02 US1.4 | US2.4 82.8,25.4 v82.93,25.27 | PCB1.5V 36.83,14.35 35.18,16 31.62,16 26.92,20.7 v26.92,30.48 | v40.51,30.48 40.64,30.35 U$3.VCC | v85.47,37.08 85.47,40.26 IMU.1
VSENS  (via drill 0.6)
  Top 0.813: R2.2 49.53,6.35 | 49.53,6.35 R1.1 | 49.53,6.35 v49.53,8
  Bottom 0.813: v49.53,8 PCB1.A0

### Text on the board
tPlace: Battery 11.2 Lipo | G | 12V | 12 | 5V | 9V | 9 | --> | --> | 5 | G | Switch | V-OUT | XL4005 - 5Amps | XL4005 - 5Amps | MPU6050 | 5V - USB | hcsr04 | hcsr04 | Motor R | Motor L | hcsr04 | Power | 330 | 100